# Altium schematic sheet [10]MISC.SchDoc
size A4
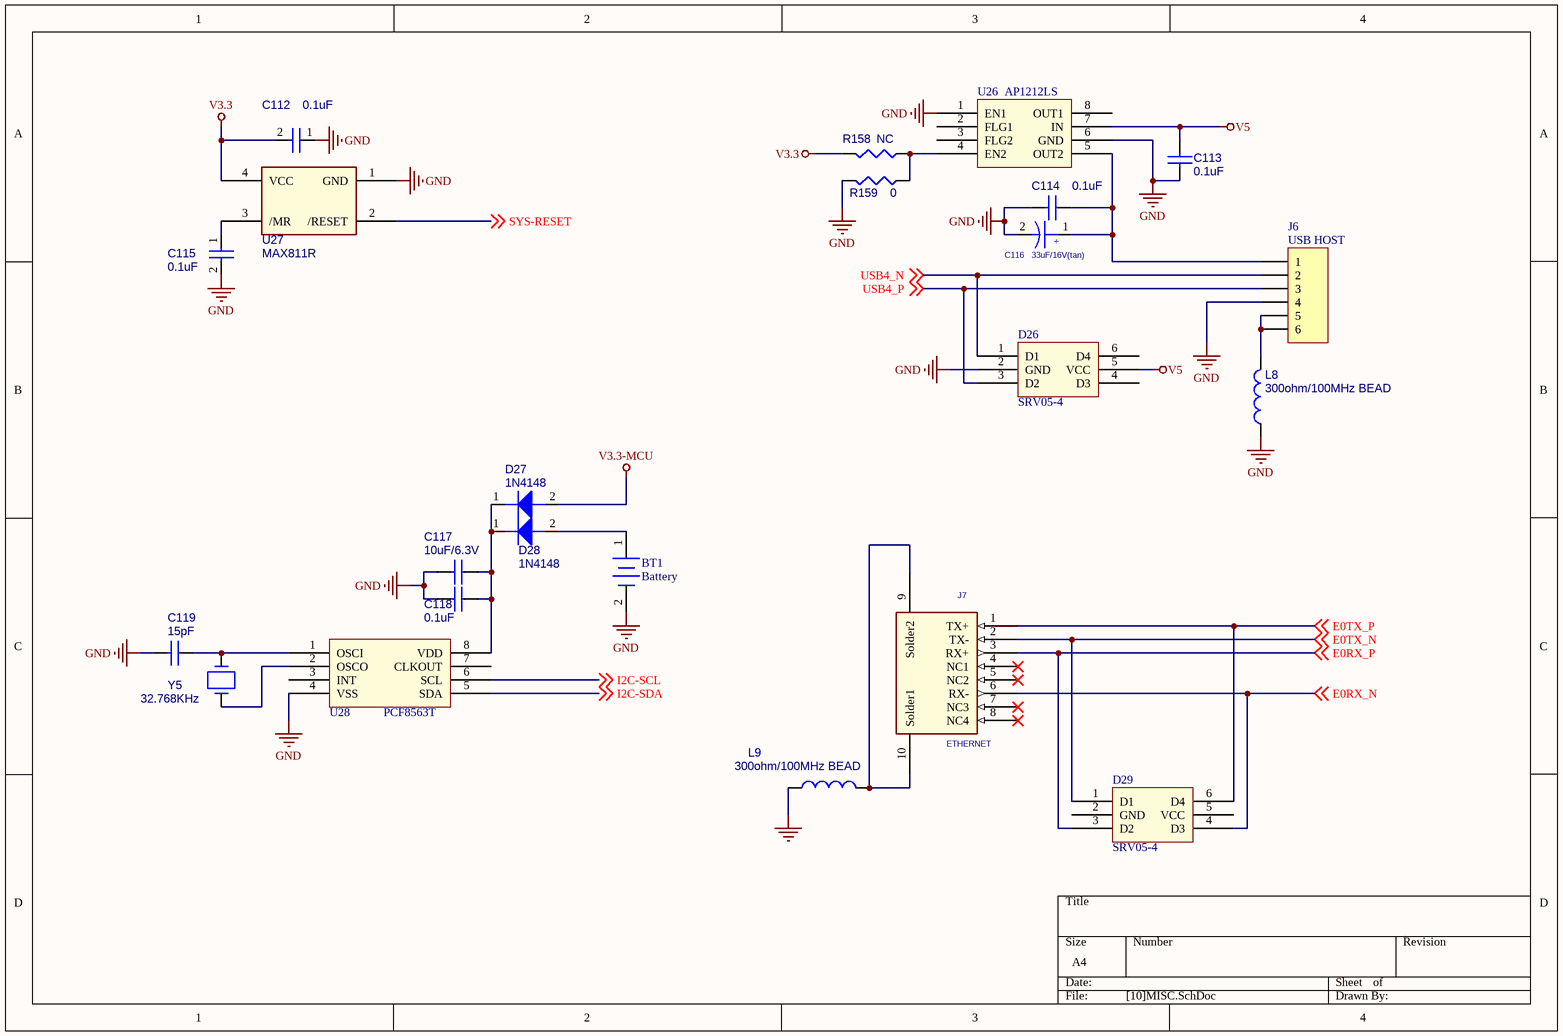
[diagram p0: [10]MISC.SchDoc]

## Parts
BT1  Battery  [CR1220]
C112  0.1uF  [0603]
C113  0.1uF  [0603]
C114  0.1uF  [0603]
C115  0.1uF  [0603]
C116  33uF/16V(tan)  [3528]
C117  10uF/6.3V  [0805]
C118  0.1uF  [0603]
C119  15pF  [0603]
D26  SRV05-4  [SOT23-6]
D27  1N4148  [MINI-MELF]
D28  1N4148  [MINI-MELF]
D29  SRV05-4  [SOT23-6]
J6  USB HOST  [USB-HOST]
J7  ETHERNET  [RJ45]
L8  300ohm/100MHz BEAD  [0603]
L9  300ohm/100MHz BEAD  [0603]
R158  NC  [0603]
R159  0  [0603]
U26  AP1212LS  [SO8]
U27  MAX811R  [SOT143]
U28  PCF8563T  [SO8]
Y5  32.768KHz  [XTAL]

## Nets
GND: BT1.2(-) C112.1 C113.2 C114.2 C115.2 C116.2 C117.2 C118.2 C119.2 D26.2(GND) J6.4 L8.2 L9.2 R159.2 U26.1(EN1) U26.6(GND) U27.1(GND) U28.4(VSS)
V3.3: C112.2 R158.2 U27.4(VCC)
V3.3-MCU: D27.2
V5: C113.1 D26.5(VCC) U26.7(IN)
E0RX_N: D29.4(D3) J7.6(RX-) ; off-sheet E0RX_N
E0RX_P: D29.3(D2) J7.3(RX+) ; off-sheet E0RX_P
E0TX_N: D29.1(D1) J7.2(TX-) ; off-sheet E0TX_N
E0TX_P: D29.6(D4) J7.1(TX+) ; off-sheet E0TX_P
I2C-SCL: U28.6(SCL) ; off-sheet I2C-SCL
I2C-SDA: U28.5(SDA) ; off-sheet I2C-SDA
SYS-RESET: U27.2(/RESET) ; off-sheet SYS-RESET
USB4_N: D26.1(D1) J6.2 ; off-sheet USB4_N
USB4_P: D26.3(D2) J6.3 ; off-sheet USB4_P
NetBT1_1: BT1.1(+) D28.2
NetC114_1: C114.1 C116.1 J6.1 U26.5(OUT2)
NetC115_1: C115.1 U27.3(/MR)
NetC117_1: C117.1 C118.1 D27.1 D28.1 U28.8(VDD)
NetC119_1: C119.1 U28.1(OSCI) Y5.2
NetJ6_5: J6.5 J6.6 L8.1
NetJ7_9: J7.9(Solder2) J7.10(Solder1) L9.1
NetR158_1: R158.1 R159.1 U26.4(EN2)
NetU28_2: U28.2(OSCO) Y5.1

Not connected (* = marked no-connect by the designer): D26 4(D3) 6(D4); D29 2(GND) 5(VCC); J7 4(NC1)* 5(NC2)* 7(NC3)* 8(NC4)*; U26 2(FLG1) 3(FLG2) 8(OUT1); U28 3(INT) 7(CLKOUT)

## Notes on the sheet
- (in symbol CAP WP) +

## Library data of the parts
BT1 = Battery: Multicell Battery
C112 C115 = CAP NP_Dup2
C113 C114 C117-C119 = CAP_Dup1
C116 = CAP WP
D27 D28 = 1N4148WS-7-F_SOD323-2
J6 = Header 6: Header, 6-Pin
J7 = NET
L8 L9 = INDUCTOR_4
R158 = R: Part Number: SD02810028L; Part Description: S RES 1/16W 10K +-5% 0402; Manufacturer Part number: null; Ecology: YES; Function Field: 32.3; Deletion Flag: 0; ROOM: SD; Lead Free: Y1; AP: AP; AP Sheet: http://ISPDPRD/Windchill/servlet/WindchillAuthGW/wt.enterprise.URLProcessor/URLTemplateAction?u8&oid=VR%3Aext.compal.part.Comp; Part Type: RESISTOR
R159 = R: Part Number: SD02810028L; Part Description: S RES 1/16W 10K +-5% 0402; Manufacturer Part number: null; Ecology: YES; Function Field: 32.3; ROOM: SD; Lead Free: Y1; AP: AP; AP Sheet: http://ISPDPRD/Windchill/servlet/WindchillAuthGW/wt.enterprise.URLProcessor/URLTemplateAction?u8&oid=VR%3Aext.compal.part.Comp; Part Type: RESISTOR; Deletion Flag: 0
U26 = AP1212
U27 = MAX811
Y5 = CRYSTAL